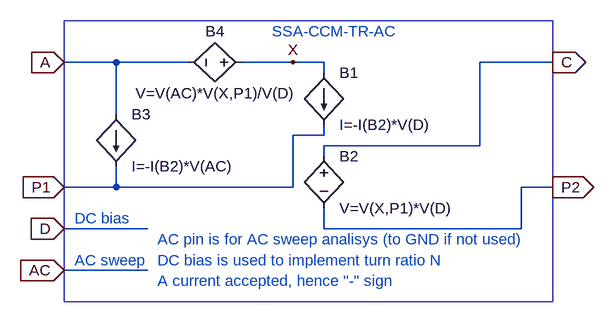
[diagram p0: schematic SSA-CCM-TR-AC.asc]
SSA-CCM-TR-AC.asc, the LTspice schematic file:
Version 4
SHEET 1 880 680
WIRE 32 -16 -48 -16
WIRE 144 -16 32 -16
WIRE 304 -16 224 -16
WIRE 352 -16 304 -16
WIRE 704 -16 592 -16
WIRE 352 0 352 -16
WIRE 32 64 32 -16
WIRE 352 96 352 80
WIRE 352 96 304 96
WIRE 592 112 592 -16
WIRE 592 112 352 112
WIRE 352 128 352 112
WIRE 32 176 32 144
WIRE 32 176 -48 176
WIRE 304 176 304 96
WIRE 304 176 32 176
WIRE 704 176 656 176
WIRE 80 240 -48 240
WIRE 352 240 352 208
WIRE 656 240 656 176
WIRE 656 240 352 240
WIRE 80 304 -48 304
FLAG -48 -16 A
IOPIN -48 -16 In
FLAG -48 176 P1
IOPIN -48 176 In
FLAG 704 -16 C
IOPIN 704 -16 Out
FLAG 704 176 P2
IOPIN 704 176 Out
FLAG -48 240 D
IOPIN -48 240 In
FLAG -48 304 AC
IOPIN -48 304 In
FLAG 304 -16 X
SYMBOL bi 352 0 R0
SYMATTR InstName B1
SYMATTR Value I=-I(B2)*V(D)
SYMBOL bv 352 112 R0
SYMATTR InstName B2
SYMATTR Value V=V(X,P1)*V(D)
SYMBOL bi 32 64 R0
SYMATTR InstName B3
SYMATTR Value I=-I(B2)*V(AC)
SYMBOL bv 240 -16 R90
WINDOW 0 -32 56 VBottom 0
WINDOW 3 32 56 VTop 0
SYMATTR InstName B4
SYMATTR Value V=V(AC)*V(X,P1)/V(D)
TEXT 272 -64 Left 0 ;SSA-CCM-TR-AC
TEXT 96 320 Left 0 ;A current accepted, hence "-" sign
TEXT -32 288 Left 0 ;AC sweep
TEXT -32 224 Left 0 ;DC bias
TEXT 96 288 Left 0 ;DC bias is used to implement turn ratio N
TEXT 96 256 Left 0 ;AC pin is for AC sweep analisys (to GND if not used)
RECTANGLE Normal 704 352 -48 -80

The netlist it stands for:
* SSA-CCM-TR-AC.asc
B1 X P1 I=-I(B2)*V(D)
B2 C P2 V=V(X,P1)*V(D)
B3 A P1 I=-I(B2)*V(AC)
B4 X A V=V(AC)*V(X,P1)/V(D)
* SSA-CCM-TR-AC
* A current accepted, hence "-" sign
* AC sweep
* DC bias
* DC bias is used to implement turn ratio N
* AC pin is for AC sweep analisys (to GND if not used)
.backanno
.end